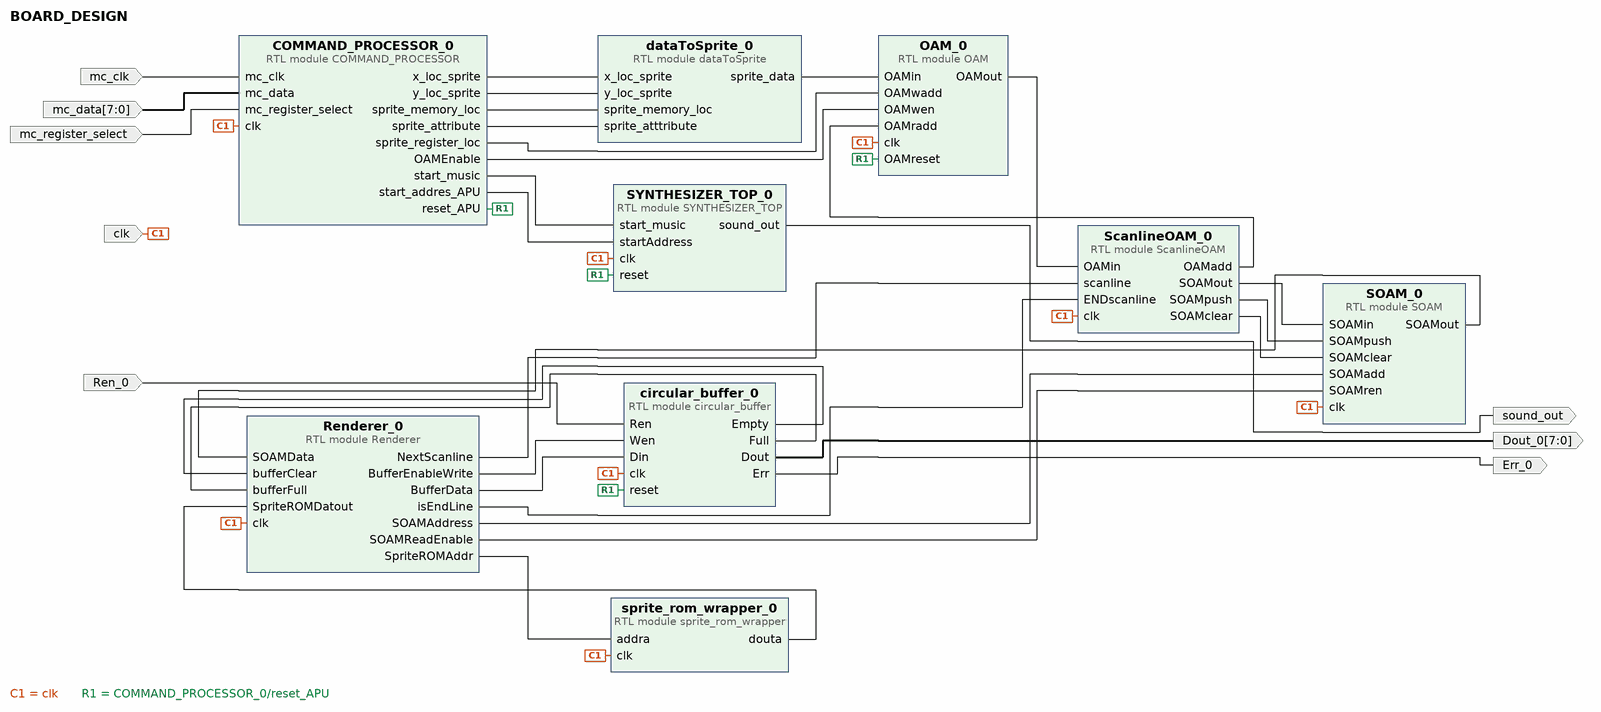
[diagram p0: block diagram of the top level]
# Vivado block design BOARD_DESIGN, xc7a35tcpg236-1, Vivado 2017.4
create_bd_design BOARD_DESIGN

create_bd_port -dir I -type clk clk
set_property -dict {CONFIG.FREQ_HZ 100000000} [get_bd_ports clk]
create_bd_port -dir I -type clk mc_clk
create_bd_port -dir I -from 7 -to 0 mc_data
create_bd_port -dir I mc_register_select
create_bd_port -dir O sound_out
create_bd_port -dir O -from 7 -to 0 Dout_0
create_bd_port -dir O Err_0
create_bd_port -dir I Ren_0

create_bd_cell -type module -reference SYNTHESIZER_TOP SYNTHESIZER_TOP_0
create_bd_cell -type module -reference ScanlineOAM ScanlineOAM_0
create_bd_cell -type module -reference circular_buffer circular_buffer_0
set_property -dict {CONFIG.data_depth 15} [get_bd_cells circular_buffer_0]
create_bd_cell -type module -reference SOAM SOAM_0
create_bd_cell -type module -reference Renderer Renderer_0
create_bd_cell -type module -reference dataToSprite dataToSprite_0
create_bd_cell -type module -reference sprite_rom_wrapper sprite_rom_wrapper_0
create_bd_cell -type module -reference COMMAND_PROCESSOR COMMAND_PROCESSOR_0
create_bd_cell -type module -reference OAM OAM_0

# ---- connections ----

connect_bd_net [get_bd_ports clk] \
  [get_bd_pins SYNTHESIZER_TOP_0/clk] [get_bd_pins ScanlineOAM_0/clk] [get_bd_pins circular_buffer_0/clk] \
  [get_bd_pins SOAM_0/clk] [get_bd_pins Renderer_0/clk] [get_bd_pins sprite_rom_wrapper_0/clk] \
  [get_bd_pins COMMAND_PROCESSOR_0/clk] [get_bd_pins OAM_0/clk]
connect_bd_net [get_bd_ports mc_clk] [get_bd_pins COMMAND_PROCESSOR_0/mc_clk]
connect_bd_net [get_bd_ports mc_data] [get_bd_pins COMMAND_PROCESSOR_0/mc_data]
connect_bd_net [get_bd_ports mc_register_select] [get_bd_pins COMMAND_PROCESSOR_0/mc_register_select]
connect_bd_net [get_bd_pins COMMAND_PROCESSOR_0/start_music] [get_bd_pins SYNTHESIZER_TOP_0/start_music]
connect_bd_net [get_bd_pins COMMAND_PROCESSOR_0/reset_APU] \
  [get_bd_pins SYNTHESIZER_TOP_0/reset] [get_bd_pins circular_buffer_0/reset] [get_bd_pins OAM_0/OAMreset]
connect_bd_net [get_bd_pins COMMAND_PROCESSOR_0/start_addres_APU] [get_bd_pins SYNTHESIZER_TOP_0/startAddress]
connect_bd_net [get_bd_pins SYNTHESIZER_TOP_0/sound_out] [get_bd_ports sound_out]
connect_bd_net [get_bd_pins OAM_0/OAMout] [get_bd_pins ScanlineOAM_0/OAMin]
connect_bd_net [get_bd_pins ScanlineOAM_0/OAMadd] [get_bd_pins OAM_0/OAMradd]
connect_bd_net [get_bd_pins Renderer_0/NextScanline] [get_bd_pins ScanlineOAM_0/scanline]
connect_bd_net [get_bd_pins Renderer_0/BufferEnableWrite] [get_bd_pins circular_buffer_0/Wen]
connect_bd_net [get_bd_pins Renderer_0/BufferData] [get_bd_pins circular_buffer_0/Din]
connect_bd_net [get_bd_pins circular_buffer_0/Empty] [get_bd_pins Renderer_0/bufferClear]
connect_bd_net [get_bd_pins circular_buffer_0/Full] [get_bd_pins Renderer_0/bufferFull]
connect_bd_net [get_bd_pins SOAM_0/SOAMout] [get_bd_pins Renderer_0/SOAMData]
connect_bd_net [get_bd_pins ScanlineOAM_0/SOAMout] [get_bd_pins SOAM_0/SOAMin]
connect_bd_net [get_bd_pins Renderer_0/SOAMAddress] [get_bd_pins SOAM_0/SOAMadd]
connect_bd_net [get_bd_pins Renderer_0/SOAMReadEnable] [get_bd_pins SOAM_0/SOAMren]
connect_bd_net [get_bd_pins ScanlineOAM_0/SOAMpush] [get_bd_pins SOAM_0/SOAMpush]
connect_bd_net [get_bd_pins ScanlineOAM_0/SOAMclear] [get_bd_pins SOAM_0/SOAMclear]
connect_bd_net [get_bd_pins Renderer_0/isEndLine] [get_bd_pins ScanlineOAM_0/ENDscanline]
connect_bd_net [get_bd_pins Renderer_0/SpriteROMAddr] [get_bd_pins sprite_rom_wrapper_0/addra]
connect_bd_net [get_bd_pins sprite_rom_wrapper_0/douta] [get_bd_pins Renderer_0/SpriteROMDatout]
connect_bd_net [get_bd_pins circular_buffer_0/Dout] [get_bd_ports Dout_0]
connect_bd_net [get_bd_pins circular_buffer_0/Err] [get_bd_ports Err_0]
connect_bd_net [get_bd_pins dataToSprite_0/sprite_data] [get_bd_pins OAM_0/OAMin]
connect_bd_net [get_bd_pins COMMAND_PROCESSOR_0/sprite_register_loc] [get_bd_pins OAM_0/OAMwadd]
connect_bd_net [get_bd_pins COMMAND_PROCESSOR_0/x_loc_sprite] [get_bd_pins dataToSprite_0/x_loc_sprite]
connect_bd_net [get_bd_pins COMMAND_PROCESSOR_0/y_loc_sprite] [get_bd_pins dataToSprite_0/y_loc_sprite]
connect_bd_net [get_bd_pins COMMAND_PROCESSOR_0/sprite_memory_loc] [get_bd_pins dataToSprite_0/sprite_memory_loc]
connect_bd_net [get_bd_pins COMMAND_PROCESSOR_0/sprite_attribute] [get_bd_pins dataToSprite_0/sprite_atttribute]
connect_bd_net [get_bd_pins COMMAND_PROCESSOR_0/OAMEnable] [get_bd_pins OAM_0/OAMwen]
connect_bd_net -net Ren_0_1 [get_bd_ports Ren_0] [get_bd_pins circular_buffer_0/Ren]

validate_bd_design
save_bd_design
